# Altium schematic sheet WIFI.SchDoc: DARKYDEN_WIFI
size Letter; ApprovedBy: APPROUVÉ PAR; Author: Harold Malbrouck; Organization: Cegep Limoilou; Address1: 1300, 8e Avenue; Address2: Québec, QC; Address3: Canada; Address4: G1J 5L5; Revision: Rev.A; SheetNumber: 14; SheetTotal: 21
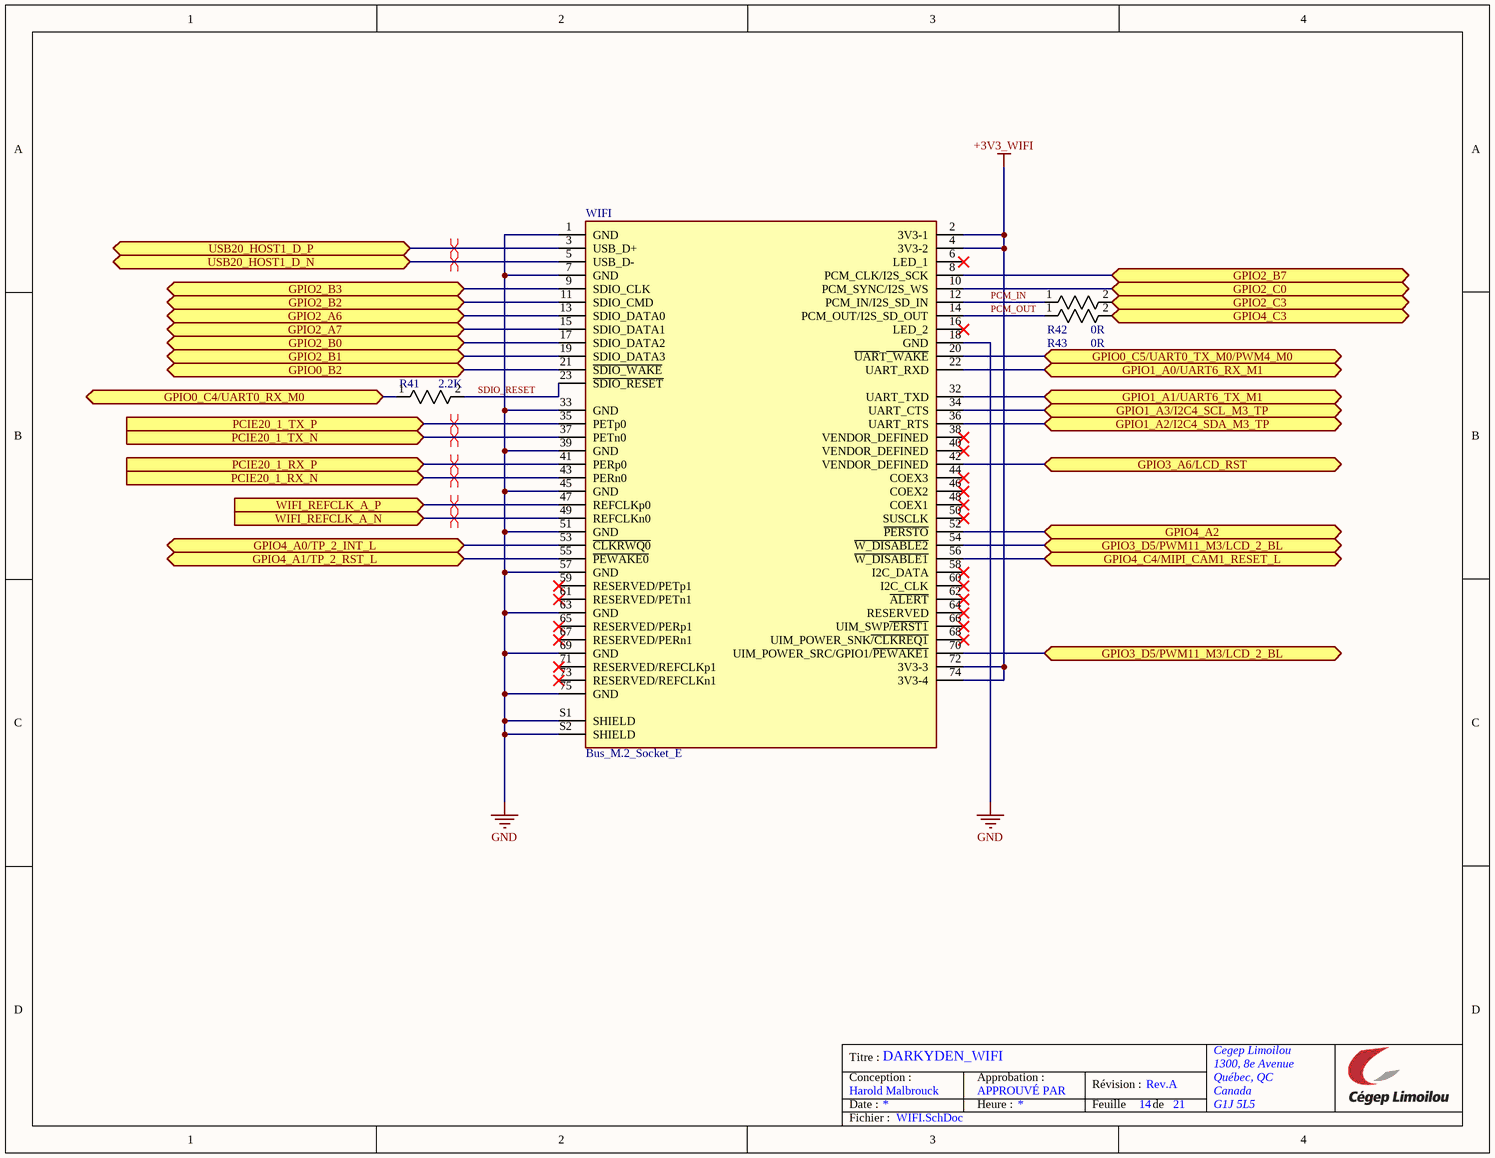
[diagram p0: WIFI.SchDoc]

## Parts
R41  2.2K  [RESC1608X55N]
R42  0R  [RESC1608X55N]
R43  0R  [RESC1608X55N]
WIFI  Bus_M.2_Socket_E  [AMPHENOL_MDT320E01001]

## Ports
GPIO0_B2 (bidir, see CONNECTEUR_3[1B]), GPIO0_C4/UART0_RX_M0 (bidir, see CONNECTEUR_3[3C]), GPIO0_C5/UART0_TX_M0/PWM4_M0 (bidir, see CONNECTEUR_3[3C]), GPIO1_A0/UART6_RX_M1 (bidir, see CONNECTEUR_3[1C]), GPIO1_A1/UART6_TX_M1 (bidir, see CONNECTEUR_3[1C]), GPIO1_A2/I2C4_SDA_M3_TP (bidir, see CONNECTEUR_3[1C]), GPIO1_A3/I2C4_SCL_M3_TP (bidir, see CONNECTEUR_3[1C]), GPIO2_A6 (bidir, see CONNECTEUR_1[1C]), GPIO2_A7 (bidir, see CONNECTEUR_1[1C]), GPIO2_B0 (bidir, see CONNECTEUR_1[1C]), GPIO2_B1 (bidir, see CONNECTEUR_1[1C]), GPIO2_B2 (bidir, see CONNECTEUR_1[1C]), GPIO2_B3 (bidir, see CONNECTEUR_1[1C]), GPIO2_B7 (bidir, see CONNECTEUR_1[1D]), GPIO2_C0 (bidir, see CONNECTEUR_1[1B]), GPIO2_C3 (bidir, see CONNECTEUR_1[1B]), GPIO3_A6/LCD_RST (bidir, see CONNECTEUR_4[2C]), GPIO3_D5/PWM11_M3/LCD_2_BL (bidir, see CONNECTEUR_4[2C], WIFI[3B]), GPIO3_D5/PWM11_M3/LCD_2_BL (bidir, see CONNECTEUR_4[2C], WIFI[3C]), GPIO4_A0/TP_2_INT_L (bidir, see CONNECTEUR_3[1B]), GPIO4_A1/TP_2_RST_L (bidir, see CONNECTEUR_3[1B]), GPIO4_A2 (bidir, see CONNECTEUR_3[1B]), GPIO4_C3 (bidir, see CONNECTEUR_1[3B]), GPIO4_C4/MIPI_CAM1_RESET_L (bidir, see CONNECTEUR_1[3B]), PCIE20_1_RX_N (in, see CONNECTEUR_3[1A]), PCIE20_1_RX_P (in, see CONNECTEUR_3[1A]), PCIE20_1_TX_N (in, see CONNECTEUR_3[1A]), PCIE20_1_TX_P (in, see CONNECTEUR_3[1A]), USB20_HOST1_D_N (bidir, see CONNECTEUR_4[3A]), USB20_HOST1_D_P (bidir, see CONNECTEUR_4[3A]), WIFI_REFCLK_A_N (in, see NVME[3C]), WIFI_REFCLK_A_P (in, see NVME[3C])

## Nets
+3V3_WIFI: WIFI.2(3V3-1) WIFI.4(3V3-2) WIFI.72(3V3-3) WIFI.74(3V3-4)
GND: WIFI.1(GND) WIFI.7(GND) WIFI.18(GND) WIFI.33(GND) WIFI.39(GND) WIFI.45(GND) WIFI.51(GND) WIFI.57(GND) WIFI.63(GND) WIFI.69(GND) WIFI.75(GND) WIFI.S1(SHIELD) WIFI.S2(SHIELD)
GPIO0_B2: WIFI.21(~{SDIO_WAKE}) ; port GPIO0_B2
GPIO0_C4/UART0_RX_M0: R41.1 ; port GPIO0_C4/UART0_RX_M0
GPIO0_C5/UART0_TX_M0/PWM4_M0: WIFI.20(~{UAR}T~{_WAKE}) ; port GPIO0_C5/UART0_TX_M0/PWM4_M0
GPIO1_A0/UART6_RX_M1: WIFI.22(UART_RXD) ; port GPIO1_A0/UART6_RX_M1
GPIO1_A1/UART6_TX_M1: WIFI.32(UART_TXD) ; port GPIO1_A1/UART6_TX_M1
GPIO1_A2/I2C4_SDA_M3_TP: WIFI.36(UART_RTS) ; port GPIO1_A2/I2C4_SDA_M3_TP
GPIO1_A3/I2C4_SCL_M3_TP: WIFI.34(UART_CTS) ; port GPIO1_A3/I2C4_SCL_M3_TP
GPIO2_A6: WIFI.13(SDIO_DATA0) ; port GPIO2_A6
GPIO2_A7: WIFI.15(SDIO_DATA1) ; port GPIO2_A7
GPIO2_B0: WIFI.17(SDIO_DATA2) ; port GPIO2_B0
GPIO2_B1: WIFI.19(SDIO_DATA3) ; port GPIO2_B1
GPIO2_B2: WIFI.11(SDIO_CMD) ; port GPIO2_B2
GPIO2_B3: WIFI.9(SDIO_CLK) ; port GPIO2_B3
GPIO2_B7: WIFI.8(PCM_CLK/I2S_SCK) ; port GPIO2_B7
GPIO2_C0: WIFI.10(PCM_SYNC/I2S_WS) ; port GPIO2_C0
GPIO2_C3: R42.2 ; port GPIO2_C3
GPIO3_A6/LCD_RST: WIFI.42(VENDOR_DEFINED) ; port GPIO3_A6/LCD_RST
GPIO3_D5/PWM11_M3/LCD_2_BL: WIFI.54(~{W_DISABLE2}) WIFI.70(UIM_POWER_SRC/GPIO1/~{PEWAKE1}) ; port GPIO3_D5/PWM11_M3/LCD_2_BL
GPIO4_A0/TP_2_INT_L: WIFI.53(~{CLKRWQ0}) ; port GPIO4_A0/TP_2_INT_L
GPIO4_A1/TP_2_RST_L: WIFI.55(~{PEWAKE0}) ; port GPIO4_A1/TP_2_RST_L
GPIO4_A2: WIFI.52(~{PERSTO}) ; port GPIO4_A2
GPIO4_C3: R43.2 ; port GPIO4_C3
GPIO4_C4/MIPI_CAM1_RESET_L: WIFI.56(~{W_DISABLE1}) ; port GPIO4_C4/MIPI_CAM1_RESET_L
PCIE20_1_RX_N: WIFI.43(PERn0) ; port PCIE20_1_RX_N
PCIE20_1_RX_P: WIFI.41(PERp0) ; port PCIE20_1_RX_P
PCIE20_1_TX_N: WIFI.37(PETn0) ; port PCIE20_1_TX_N
PCIE20_1_TX_P: WIFI.35(PETp0) ; port PCIE20_1_TX_P
PCM_IN: R42.1 WIFI.12(PCM_IN/I2S_SD_IN)
PCM_OUT: R43.1 WIFI.14(PCM_OUT/I2S_SD_OUT)
SDIO_RESET: R41.2 WIFI.23(~{SDIO_RESET})
USB20_HOST1_D_N: WIFI.5(USB_D-) ; port USB20_HOST1_D_N
USB20_HOST1_D_P: WIFI.3(USB_D+) ; port USB20_HOST1_D_P
WIFI_REFCLK_A_N: WIFI.49(REFCLKn0) ; port WIFI_REFCLK_A_N
WIFI_REFCLK_A_P: WIFI.47(REFCLKp0) ; port WIFI_REFCLK_A_P

Not connected (* = marked no-connect by the designer): WIFI 6(LED_1)* 16(LED_2)* 38(VENDOR_DEFINED)* 40(VENDOR_DEFINED)* 44(COEX3)* 46(COEX2)* 48(COEX1)* 50(SUSCLK)* 58(I2C_DATA)* 59(RESERVED/PETp1)* 60(I2C_CLK)* 61(RESERVED/PETn1)* 62(~{ALERT})* 64(RESERVED)* 65(RESERVED/PERp1)* 66(UIM_SWP~{/ERST1})* 67(RESERVED/PERn1)* 68(UIM_POWER_SNK~{/CLKREQ1})* 71(RESERVED/REFCLKp1)* 73(RESERVED/REFCLKn1)*

## Layout directives
differential pair; differential pair class WIFI_DIFF: PCIE20_1_RX_N, PCIE20_1_RX_P, PCIE20_1_TX_N, PCIE20_1_TX_P, USB20_HOST1_D_N, USB20_HOST1_D_P, WIFI_REFCLK_A_N, WIFI_REFCLK_A_P

## Notes on the sheet
- Titre :
- Conception :
- Date :
- Approbation :
- Heure :
- Révision :
- Feuille
- de
- Fichier :

## Library data of the parts
R41 = ERJ-3GEYJ222V: 2.2 kOhm, ï¿½ 5%, 100 mW, 0603 [1608 Metric], Thick Film, General Purpose; Manufacturer_Name: Panasonic; Value: 2.2kR; Power Rating: 100mW; Voltage Rating: 75V; Temperature Coefficient: 200ppm/°C; Voltage Rating (DC): 50V; Datasheet Link: http://docs-europe.electrocomponents.com/webdocs/13ba/0900766b813ba21b.pdf; Height: 0.55mm; Mouser Part Number: 667-ERJ-3GEYJ222V; Mouser Price/Stock: https://www.mouser.co.uk/ProductDetail/Panasonic/ERJ-3GEYJ222V?qs=4WZYzuGhm5pzxkuuO4fqIg%3D%3D; Arrow Part Number: ERJ-3GEYJ222V; Arrow Price/Stock: https://www.arrow.com/en/products/erj-3geyj222v/panasonic?region=nac; Supplier: Digikey; Supplier Part Number: P2.2KGCT-ND; Manufacturer: Panasonic; Manufacturer Part Number: ERJ-3GEYJ222V; RoHS: Yes; Category: Chip SMD Resistors; Stock: 308618; Pricing: 1=0.1, 10=0.033, 50=0.02, 100=0.0165, 500=0.01096, 1000=0.00939 (USD); Mounting Technology: Surface Mount; Case/Package: 0603; Case Code (Imperial): 0603; Case Code (Metric): 1608; Contact Plating: Tin; Min Operating Temperature: -55°C; Max Operating Temperature: 155°C; Package Quantity: 1; Packaging: Tape and Reel; Tolerance: 5%; Resistor Type: Thick Film; Number of Terminations: 2; Termination: SMD/SMT; Max Power Dissipation: 100mW; Working Voltage: 75V; Features: Automotive AEC-Q200; Series: ERJ; Resistance Tolerance: 5%; Construction: Rectangular; Technology: THICK FILM; Length: 1.6mm; Width: 0.8mm; Depth: 0.8mm; Radiation Hardening: No; Reach SVHC Compliant: No; Military Standard: Not; Lead Free: Lead Free; RoHS Compliant: Yes; ComponentLink1URL: https://datasheet.ciiva.com/11821/0900766b80f806dd-11821453.pdf?src-supplier=Rs; ComponentLink1Description: https://datasheet.ciiva.com/11821/0900766b80f806dd-11821453.pdf?src-supplier=Rs; ComponentLink2URL: https://datasheet.ciiva.com/34303/1988639-34303614.pdf?src-supplier=Jameco; ComponentLink2Description: https://datasheet.ciiva.com/34303/1988639-34303614.pdf?src-supplier=Jameco; ComponentLink3URL: https://datasheet.ciiva.com/22758/1500035-22758223.pdf?src-supplier=Farnell; ComponentLink3Description: https://datasheet.ciiva.com/22758/1500035-22758223.pdf?src-supplier=Farnell; ComponentLink4URL: https://datasheet.ciiva.com/9117/aoa0000ce1-9117127.pdf?src-supplier=Avnet; ComponentLink4Description: https://datasheet.ciiva.com/9117/aoa0000ce1-9117127.pdf?src-supplier=Avnet; ComponentLink5URL: https://datasheet.ciiva.com/28584/1678796-28584095.pdf?src-supplier=Element14; ComponentLink5Description: https://datasheet.ciiva.com/28584/1678796-28584095.pdf?src-supplier=Element14; ComponentLink6URL: https://datasheet.ciiva.com/46380/1500035-46380411.pdf?src-supplier=Element14; ComponentLink6Description: https://datasheet.ciiva.com/46380/1500035-46380411.pdf?src-supplier=Element14; ComponentLink7URL: https://datasheet.ciiva.com/16760/70255313-16760341.pdf?src-supplier=Allied+Electronics; ComponentLink7Description: https://datasheet.ciiva.com/16760/70255313-16760341.pdf?src-supplier=Allied+Electronics; ComponentLink8URL: https://datasheet.ciiva.com/16765/70255313-16765244.pdf?src-supplier=Allied+Electronics; ComponentLink8Description: https://datasheet.ciiva.com/16765/70255313-16765244.pdf?src-supplier=Allied+Electronics; ComponentLink9URL: https://datasheet.ciiva.com/16199/aoa0000ce1-16199902.pdf?src-supplier=Future+Electronics; ComponentLink9Description: https://datasheet.ciiva.com/16199/aoa0000ce1-16199902.pdf?src-supplier=Future+Electronics
R42 R43 = ERJ-3GEY0R00V: Zero Ohm Resistor, Jumper, 0603 [1608 Metric], Thick Film, 100 mW, 1 A, Surface Mount; Manufacturer_Name: Panasonic; Power Rating: 100mW; Voltage Rating: 75V; Tolerance: 0%; Temperature Coefficient: 200ppm/°C; Datasheet Link: http://docs-europe.electrocomponents.com/webdocs/13ba/0900766b813ba21b.pdf; Height: 0.55mm; Mouser Part Number: 667-ERJ-3GEY0R00V; Mouser Price/Stock: https://www.mouser.co.uk/ProductDetail/Panasonic/ERJ-3GEY0R00V?qs=66DK8nO8gJALIOqOWgiVwg%3D%3D; Arrow Part Number: ERJ-3GEY0R00V; Arrow Price/Stock: https://www.arrow.com/en/products/erj3gey0r00v/panasonic?region=europe; Supplier: Digikey; Supplier Part Number: P0.0GCT-ND; Manufacturer: Panasonic; Manufacturer Part Number: ERJ-3GEY0R00V; RoHS: Yes; Category: Chip SMD Resistors; Stock: 766631; Pricing: 1=0.1, 10=0.02, 25=0.0164, 50=0.0144, 100=0.0126, 250=0.0106, 500=0.00936, 1000=0.0083 (USD); Mounting Technology: Surface Mount; Case/Package: 0603; Case Code (Metric): 1608; Case Code (Imperial): 0603; Contact Plating: Tin; Min Operating Temperature: -55°C; Max Operating Temperature: 155°C; Packaging: Tape and Reel; Package Quantity: 5000; Value: 0R; Resistor Type: Thick Film; Number of Terminations: 2; Termination: SMD/SMT; Max Power Dissipation: 100mW; Features: Automotive AEC-Q200; Series: ERJ; Construction: Rectangular; Technology: THICK FILM; Length: 1.6mm; Width: 0.8mm; Depth: 0.8mm; Ratings: AEC-Q200; Radiation Hardening: No; Reach SVHC Compliant: No; Military Standard: Not; RoHS Compliant: Yes; Lead Free: 5697LeadFree; ComponentLink1URL: https://datasheet.ciiva.com/11808/0900766b80f806dd-11808207.pdf?src-supplier=Rs; ComponentLink1Description: https://datasheet.ciiva.com/11808/0900766b80f806dd-11808207.pdf?src-supplier=Rs; ComponentLink2URL: https://datasheet.ciiva.com/27055/1935748-27055113.pdf?src-supplier=Jameco; ComponentLink2Description: https://datasheet.ciiva.com/27055/1935748-27055113.pdf?src-supplier=Jameco; ComponentLink3URL: https://datasheet.ciiva.com/5959/1678796-5959707.pdf?src-supplier=Farnell; ComponentLink3Description: https://datasheet.ciiva.com/5959/1678796-5959707.pdf?src-supplier=Farnell; ComponentLink4URL: https://datasheet.ciiva.com/43460/1678796-43460647.pdf?src-supplier=Farnell; ComponentLink4Description: https://datasheet.ciiva.com/43460/1678796-43460647.pdf?src-supplier=Farnell; ComponentLink5URL: https://datasheet.ciiva.com/48532/aoa0000ce1-48532165.pdf?src-supplier=Avnet; ComponentLink5Description: https://datasheet.ciiva.com/48532/aoa0000ce1-48532165.pdf?src-supplier=Avnet; ComponentLink6URL: https://datasheet.ciiva.com/28695/1678796-28695833.pdf?src-supplier=Element14; ComponentLink6Description: https://datasheet.ciiva.com/28695/1678796-28695833.pdf?src-supplier=Element14; ComponentLink7URL: https://datasheet.ciiva.com/16834/aoa0000ce1-16834828.pdf?src-supplier=Future+Electronics; ComponentLink7Description: https://datasheet.ciiva.com/16834/aoa0000ce1-16834828.pdf?src-supplier=Future+Electronics; ComponentLink8URL: https://datasheet.ciiva.com/16758/70255313-16758527.pdf?src-supplier=Allied+Electronics; ComponentLink8Description: https://datasheet.ciiva.com/16758/70255313-16758527.pdf?src-supplier=Allied+Electronics; ComponentLink9URL: https://datasheet.ciiva.com/30199/4aoa0000ce1-30199822.pdf?src-supplier=Onlinecomponents.com; ComponentLink9Description: https://datasheet.ciiva.com/30199/4aoa0000ce1-30199822.pdf?src-supplier=Onlinecomponents.com; ComponentLink10URL: https://datasheet.ciiva.com/46377/1678796-46377868.pdf?src-supplier=Element14; ComponentLink10Description: https://datasheet.ciiva.com/46377/1678796-46377868.pdf?src-supplier=Element14; ComponentLink11URL: https://datasheet.ciiva.com/9198/aoa0000ce1-9198975.pdf?src-supplier=Avnet; ComponentLink11Description: https://datasheet.ciiva.com/9198/aoa0000ce1-9198975.pdf?src-supplier=Avnet
WIFI = Bus_M.2_Socket_E: PCIe M.2 Connectors, Storage and Server Connector, P=0.5mm, H=3.2mm, Key E,30Î¼in Au Plating; Manufacturer Part Number: MDT320E01001; MF: Amphenol ICC; Package: None; SnapEDA_Link: https://www.snapeda.com/parts/MDT320E01001/Amphenol+FCI/view-part/?ref=snap; Value: *; Purchase-URL: https://pricing.snapeda.com/search/part/MDT320E01001/?ref=eda; Availability: In Stock; Price: None